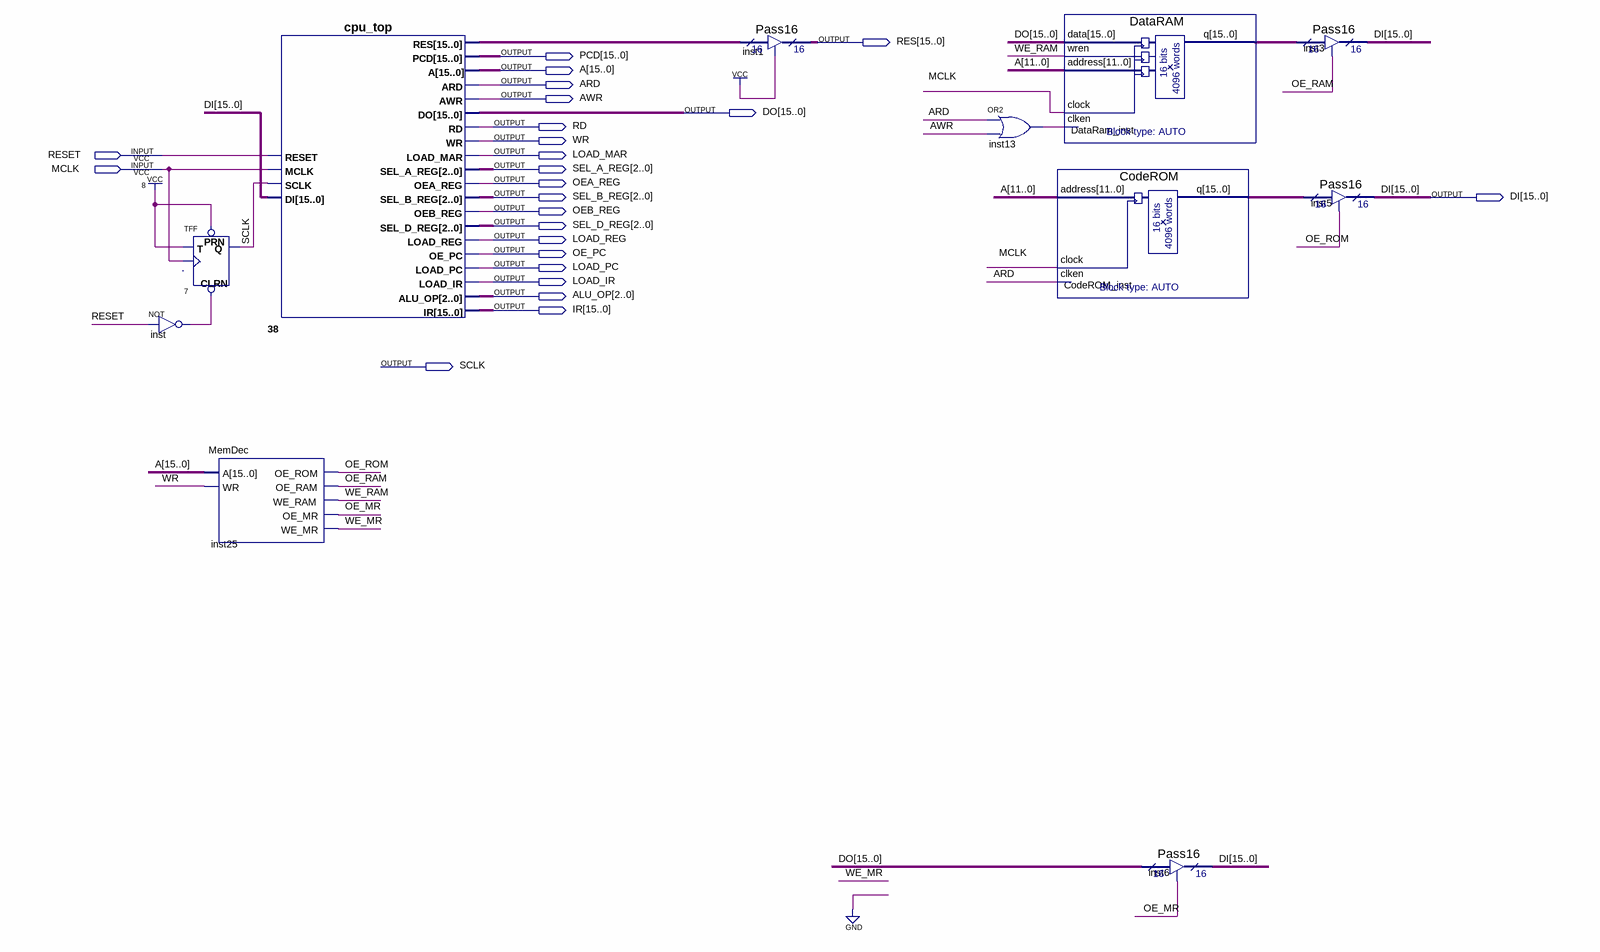
[diagram p0: schematic sheet]
// Quartus schematic cpu_top_sim.bdf as structural Verilog: 11 symbols, 24 pins
module cpu_top_sim (
  input  RESET,
  input  MCLK,
  output [15:0] RES,
  output [15:0] PCD,
  output [15:0] A,
  output ARD,
  output AWR,
  output [15:0] DO,
  output RD,
  output WR,
  output LOAD_MAR,
  output [2:0] SEL_A_REG,
  output OEA_REG,
  output [2:0] SEL_B_REG,
  output [15:0] DI,
  output OEB_REG,
  output [2:0] SEL_D_REG,
  output LOAD_REG,
  output OE_PC,
  output LOAD_PC,
  output LOAD_IR,
  output [2:0] ALU_OP,
  output [15:0] IR,
  output SCLK
);

  wire inst13_out, inst_out, OE_MR, OE_RAM, OE_ROM, WE_MR, WE_RAM;
  wire [15:0] CodeROM_inst_q, DataRam_inst_q, n38_res;

  not inst (inst_out, RESET);
  TFF u_7 (.PRN(1'b1), .CLRN(inst_out), .T(1'b1), .CLK(MCLK), .Q(SCLK));
  MemDec inst25 (.A(A), .WR(WR), .OE_ROM(OE_ROM), .OE_RAM(OE_RAM), .WE_RAM(WE_RAM), .OE_MR(OE_MR), .WE_MR(WE_MR));
  cpu_top u_38 (
    .RESET(RESET), .MCLK(MCLK), .SCLK(SCLK), .DI(DI), .PCD(PCD), .A(A), .ARD(ARD), .AWR(AWR), .DO(DO),
    .RD(RD), .WR(WR), .LOAD_MAR(LOAD_MAR), .SEL_A_REG(SEL_A_REG), .OEA_REG(OEA_REG), .SEL_B_REG(SEL_B_REG),
    .OEB_REG(OEB_REG), .SEL_D_REG(SEL_D_REG), .LOAD_REG(LOAD_REG), .OE_PC(OE_PC), .LOAD_PC(LOAD_PC),
    .LOAD_IR(LOAD_IR), .ALU_OP(ALU_OP), .IR(IR), .RES(n38_res));
  Pass16 inst1 (.enabledt(1'b1), .data(n38_res), .tridata(RES));
  or inst13 (inst13_out, ARD, AWR);
  DataRAM DataRam_inst (
    .data(DO), .wren(WE_RAM), .address(A[11:0]), .clock(MCLK), .clken(inst13_out), .q(DataRam_inst_q));
  CodeROM CodeROM_inst (.address(A[11:0]), .clock(MCLK), .clken(ARD), .q(CodeROM_inst_q));
  Pass16 inst6 (.enabledt(OE_MR), .data(DO), .tridata(DI));
  Pass16 inst3 (.enabledt(OE_RAM), .data(DataRam_inst_q), .tridata(DI));
  Pass16 inst5 (.enabledt(OE_ROM), .data(CodeROM_inst_q), .tridata(DI));
endmodule
